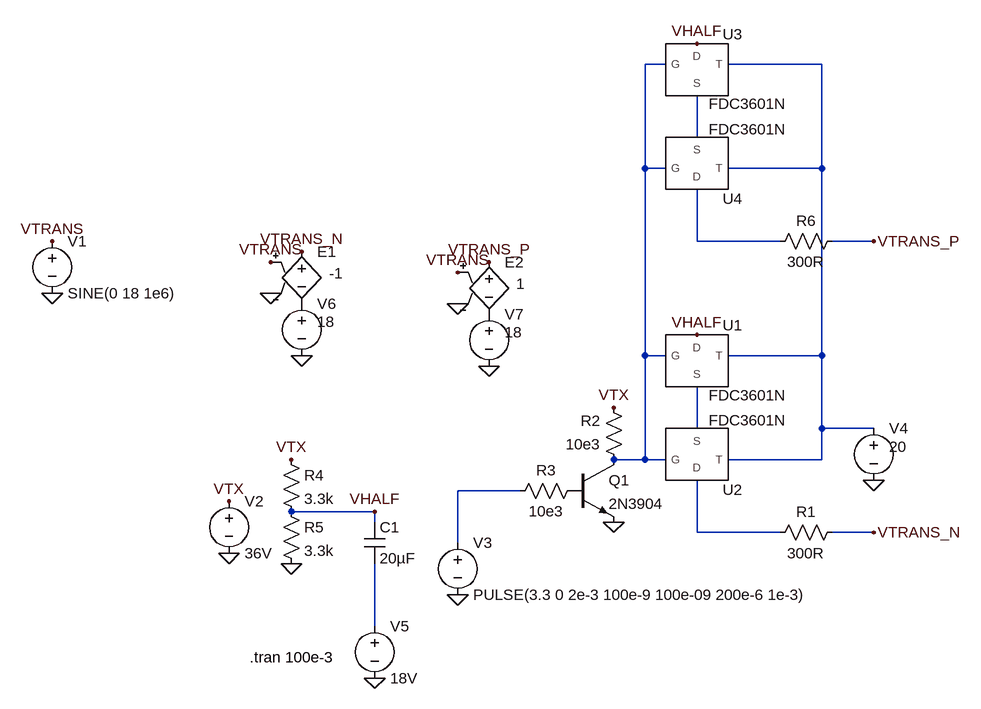
[diagram p0: schematic Damping.asc]
Damping.asc, the LTspice schematic file:
Version 4
SHEET 1 880 680
WIRE 48 -416 16 -416
WIRE 288 -416 144 -416
WIRE 96 -304 96 -368
WIRE 16 -256 16 -416
WIRE 48 -256 16 -256
WIRE 288 -256 288 -416
WIRE 288 -256 144 -256
WIRE 96 -144 96 -224
WIRE 224 -144 96 -144
WIRE 368 -144 304 -144
WIRE 16 32 16 -256
WIRE 48 32 16 32
WIRE 288 32 288 -256
WIRE 288 32 144 32
WIRE 96 144 96 80
WIRE 288 144 288 32
WIRE 368 144 288 144
WIRE 16 192 16 32
WIRE 16 192 -32 192
WIRE 48 192 16 192
WIRE 288 192 288 144
WIRE 288 192 144 192
WIRE -176 240 -272 240
WIRE -400 272 -528 272
WIRE -400 288 -400 272
WIRE 96 304 96 224
WIRE 224 304 96 304
WIRE 368 304 304 304
WIRE -272 320 -272 240
WIRE -400 448 -400 352
FLAG -32 288 0
FLAG -624 336 0
FLAG -896 -64 0
FLAG -624 256 VTX
FLAG -32 112 VTX
FLAG 96 0 VHALF
FLAG -272 400 0
FLAG 368 224 0
FLAG -528 352 0
FLAG -528 192 VTX
FLAG -400 272 VHALF
FLAG -400 528 0
FLAG 96 -448 VHALF
FLAG -896 -144 VTRANS
FLAG -560 -64 0
FLAG -560 -112 VTRANS
FLAG -512 -128 VTRANS_N
FLAG 368 -144 VTRANS_P
FLAG 368 304 VTRANS_N
FLAG -512 32 0
FLAG -272 -48 0
FLAG -272 -96 VTRANS
FLAG -224 -112 VTRANS_P
FLAG -224 48 0
SYMBOL res 320 288 R90
WINDOW 0 0 56 VBottom 2
WINDOW 3 32 56 VTop 2
SYMATTR InstName R1
SYMATTR Value 300R
SYMBOL res -16 208 R180
WINDOW 0 36 76 Left 2
WINDOW 3 36 40 Left 2
SYMATTR InstName R2
SYMATTR Value 10e3
SYMBOL npn -96 192 R0
SYMATTR InstName Q1
SYMATTR Value 2N3904
SYMBOL voltage -896 -160 R0
WINDOW 123 0 0 Left 0
WINDOW 39 0 0 Left 0
SYMATTR InstName V1
SYMATTR Value SINE(0 18 1e6)
SYMBOL voltage -624 240 R0
SYMATTR InstName V2
SYMATTR Value 36V
SYMBOL res -80 224 R90
WINDOW 0 0 56 VBottom 2
WINDOW 3 32 56 VTop 2
SYMATTR InstName R3
SYMATTR Value 10e3
SYMBOL voltage -272 304 R0
WINDOW 123 0 0 Left 0
WINDOW 39 0 0 Left 0
SYMATTR InstName V3
SYMATTR Value PULSE(3.3 0 2e-3 100e-9 100e-09 200e-6 1e-3)
SYMBOL FDC3601N 96 32 R0
SYMATTR InstName U1
SYMBOL voltage 368 128 R0
WINDOW 3 24 44 Left 2
WINDOW 123 0 0 Left 0
WINDOW 39 0 0 Left 0
SYMATTR InstName V4
SYMATTR Value 20
SYMBOL FDC3601N 96 192 M180
SYMATTR InstName U2
SYMBOL cap -416 288 R0
SYMATTR InstName C1
SYMATTR Value 20µF
SYMBOL res -544 176 R0
SYMATTR InstName R4
SYMATTR Value 3.3k
SYMBOL res -544 256 R0
SYMATTR InstName R5
SYMATTR Value 3.3k
SYMBOL voltage -400 432 R0
SYMATTR InstName V5
SYMATTR Value 18V
SYMBOL res 320 -160 R90
WINDOW 0 0 56 VBottom 2
WINDOW 3 32 56 VTop 2
SYMATTR InstName R6
SYMATTR Value 300R
SYMBOL FDC3601N 96 -416 R0
SYMATTR InstName U3
SYMBOL FDC3601N 96 -256 M180
SYMATTR InstName U4
SYMBOL e -512 -144 R0
WINDOW 3 42 49 Left 2
SYMATTR InstName E1
SYMATTR Value -1
SYMBOL voltage -512 -64 R0
WINDOW 3 24 44 Left 2
WINDOW 123 0 0 Left 0
WINDOW 39 0 0 Left 0
SYMATTR InstName V6
SYMATTR Value 18
SYMBOL e -224 -128 R0
WINDOW 3 42 49 Left 2
SYMATTR InstName E2
SYMATTR Value 1
SYMBOL voltage -224 -48 R0
WINDOW 3 24 44 Left 2
WINDOW 123 0 0 Left 0
WINDOW 39 0 0 Left 0
SYMATTR InstName V7
SYMATTR Value 18
TEXT -592 496 Left 2 !.tran 100e-3

The netlist it stands for:
* Damping.asc
R1 VTRANS_N N007 300R
R2 N001 VTX 10e3
Q1 N001 P001 0 0 2N3904
V1 VTRANS 0 SINE(0 18 1e6)
V2 VTX 0 36V
R3 P001 N006 10e3
V3 N006 0 PULSE(3.3 0 2e-3 100e-9 100e-09 200e-6 1e-3)
XU1 VHALF N001 N005 N002 FDC3601N  ; pins D G S T
V4 N002 0 20
XU2 N007 N001 N005 N002 FDC3601N  ; pins D G S T
C1 VHALF N008 20µF
R4 VTX VHALF 3.3k
R5 VHALF 0 3.3k
V5 N008 0 18V
R6 VTRANS_P N004 300R
XU3 VHALF N001 N003 N002 FDC3601N  ; pins D G S T
XU4 N004 N001 N003 N002 FDC3601N  ; pins D G S T
E1 VTRANS_N P002 VTRANS 0 -1
V6 P002 0 18
E2 VTRANS_P P003 VTRANS 0 1
V7 P003 0 18
.model NPN NPN
.model PNP PNP
.lib standard.bjt
.tran 100e-3
.lib C:\Users\Kenneth\GitHub\ping-dev-kit\sims\FDC3601N.mod
.backanno
.end